# EAGLE design WildlifeCamera (EAGLE 9.6.2)
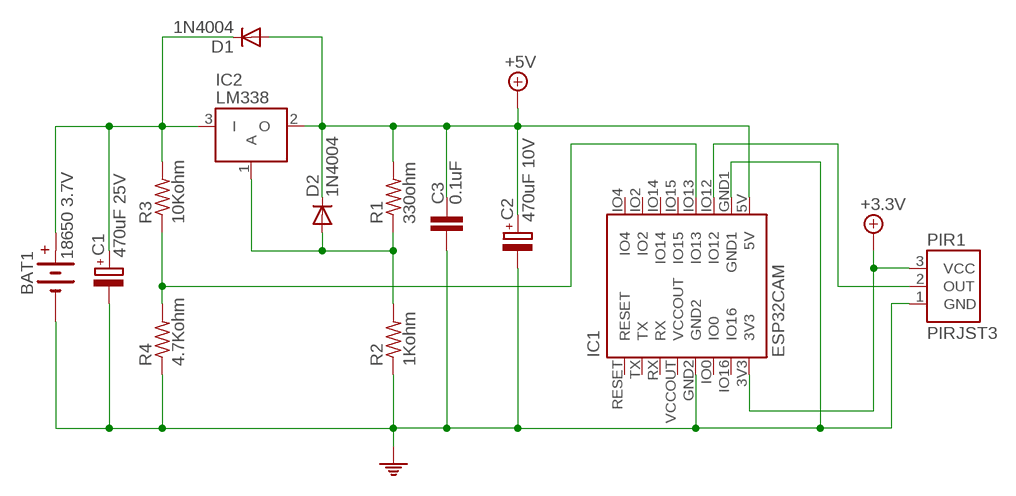
[diagram p0: schematic, sheet 1]

## Parts
BAT1  18650 3.7V  BATTERYSIL2  [SIL2]
C1  470uF 25V  CAPACITOR_EL5MM  [CAPACITOR-5MM]
C2  470uF 10V  CAPACITOR_EL5MM  [CAPACITOR-5MM]
C3  0.1uF  CAPACITOR5MM  [CAPACITOR-5MM]
D1  1N4004  DIODEBIG  [DIODE-BIG]
D2  1N4004  DIODEBIG  [DIODE-BIG]
IC1  ESP32CAM  [ESP32CAM]
IC2  LM338  LM317TO220  [TO220]
PIR1  PIRJST3  [JST3]
R1  330ohm  RESISTOR0.25W  [RESISTOR-0.25W]
R2  1Kohm  RESISTOR0.25W  [RESISTOR-0.25W]
R3  10Kohm  RESISTOR0.25W  [RESISTOR-0.25W]
R4  4.7Kohm  RESISTOR0.25W  [RESISTOR-0.25W]

## Nets
+3.3V: IC1.3V3 PIR1.3(VCC)
+5V: C2.1 C3.1 D1.A D2.C IC1.5V IC2.2(O) R1.2
GND: BAT1.2(-) C1.2 C2.2 C3.2 IC1.GND1 IC1.GND2 PIR1.1(GND) R2.1 R4.1
N$1: BAT1.1(+) C1.1 D1.C IC2.3(I) R3.2
N$2: IC1.IO13 R3.1 R4.2
N$3: D2.A IC2.1(A) R1.1 R2.2
N$6: IC1.IO12 PIR1.2(OUT)
Unconnected: IC1.IO0 IC1.IO2 IC1.IO4 IC1.IO14 IC1.IO15 IC1.IO16 IC1.RESET IC1.RX IC1.TX

## Power pins joined to a net without a drawn wire
VCCOUT: IC1.VCCOUT

## Library data of the parts
BAT1 = wizzent:BATTERY: Battery
C1 C2 = wizzent:CAPACITOR_EL: Electrolytic Capacitor
C3 = wizzent:CAPACITOR: Capacitor
D1 D2 = wizzent:DIODE: Diode
IC1 = wizzent:ESP32CAM: ESP32CAM
IC2 = wizzent:LM317: LM317 LM338; SPICEPREFIX: J
PIR1 = wizzent:PIR: PIR
R1-R4 = wizzent:RESISTOR: Resistor

## Board
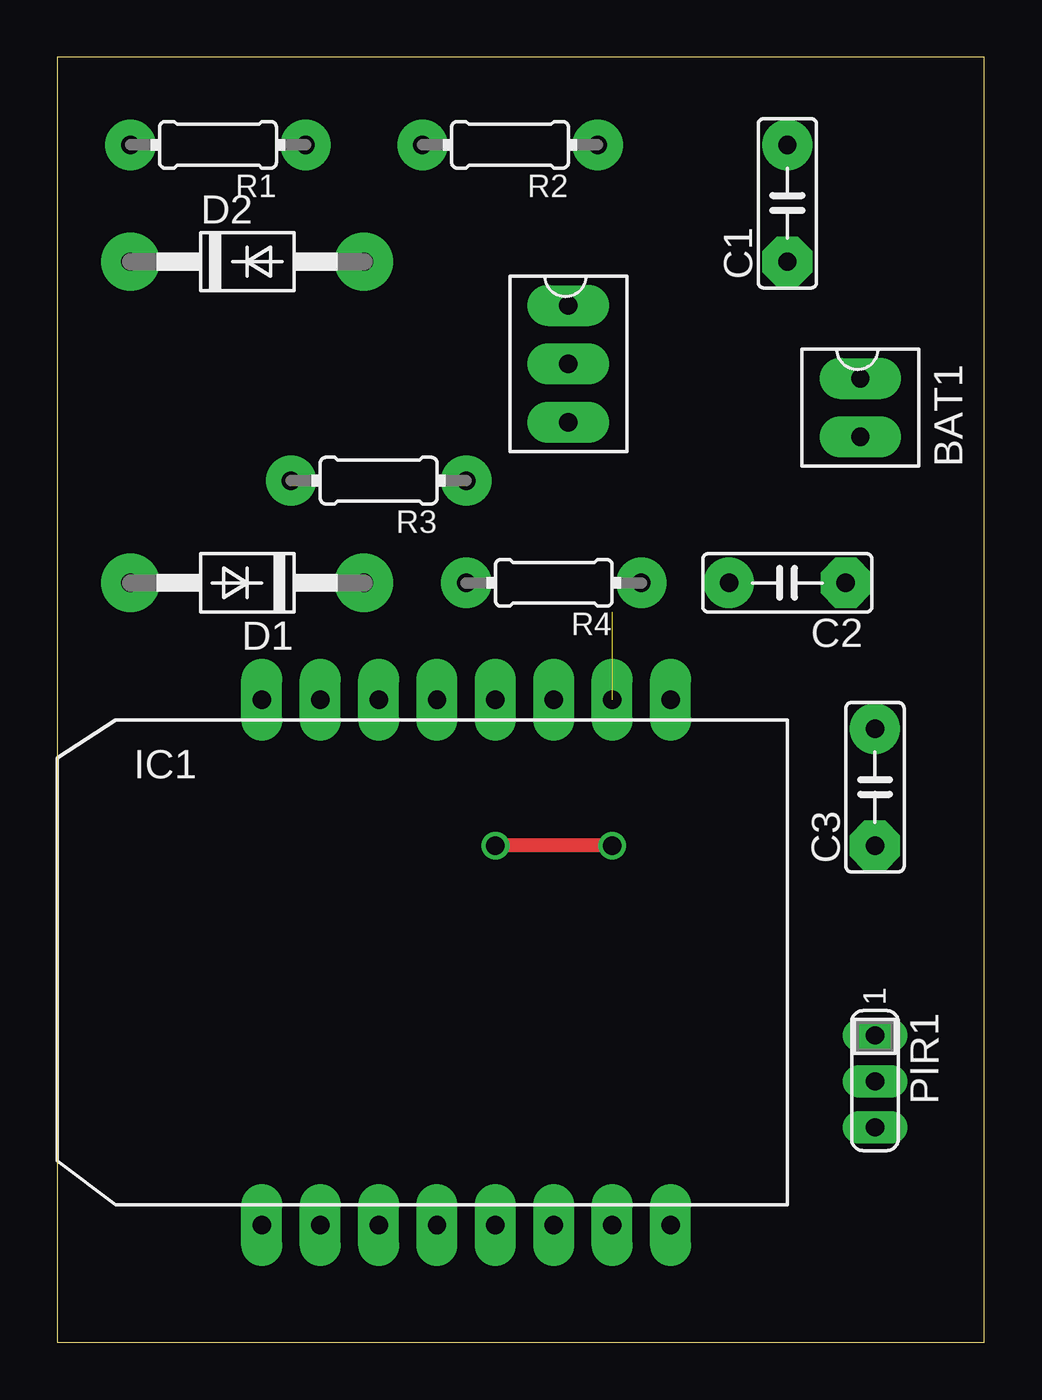
[diagram p1: board, top side]
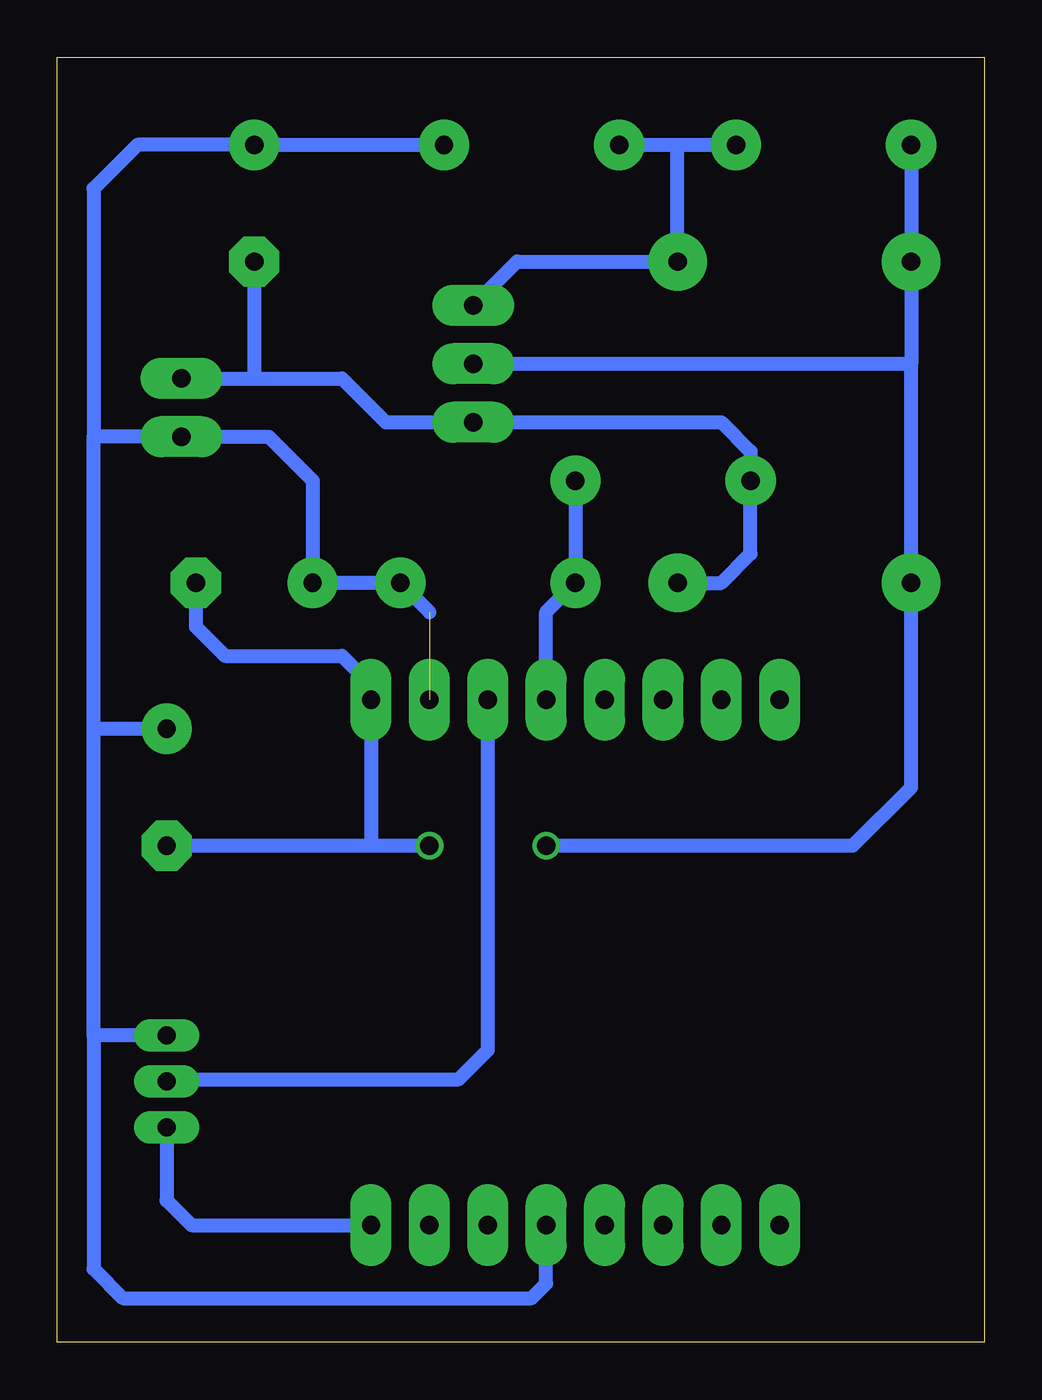
[diagram p2: board, bottom side, seen from below]

Size 40.31 x 55.87 mm. Coordinates in mm from the lower left corner, seen from the top.
Outline: 0,0 40.31,0 40.31,55.87 0,55.87 0,0
Copper layers (1*16): Top 0.035mm / dielectric 1.5mm / Bottom 0.035mm
Design rules "default": minimum track width 6mil, minimum drill 0.35mm, track to track 6mil, track to pad 6mil, pad to pad 6mil, via to via 6mil, smd to smd 6mil, copper to edge 40mil, drill to drill 6mil, minimum pad ring 10mil, minimum via ring 8mil, stop-mask expansion 4mil, vias tented up to drill 0mil, thermal gap 10mil

### Footprints (pad centres in the part's own frame; a part is rotated, then mirrored left to right if it is on the bottom)
SIL2 = drill 0.8 pad 1.778 long: 1 0,0; 2 2.54,0
CAPACITOR-5MM = drill 0.8 pad 2.184 octagon: 1 -2.54,0 | drill 0.8 pad 2.184: 2 2.54,0
DIODE-BIG = drill 0.8 pad 2.54: A 5.08,0; C -5.08,0
ESP32CAM = drill 0.8 pad 1.778 long: 3V3 17.78,0; 5V 17.78,22.86; GND1 15.24,22.86; GND2 10.16,0; IO0 12.7,0; IO2 2.54,22.86; IO4 0,22.86; IO12 12.7,22.86; IO13 10.16,22.86; IO14 5.08,22.86; IO15 7.62,22.86; IO16 15.24,0; RESET 0,0; RX 5.08,0; TX 2.54,0; VCCOUT 7.62,0
TO220 = drill 0.8 pad 1.778 long: 1 0,0; 2 2.54,0; 3 5.08,0
JST3 = drill 0.8 pad 1.422 long: 1 0,0; 2 2,0; 3 4,0
RESISTOR-0.25W = drill 0.8 pad 2.184: 1 -3.81,0; 2 3.81,0

### Placement (x,y rotation side)
BAT1  34.92,41.91 270 top
C1  31.75,49.53 90 top
C2  31.75,33.02 180 top
C3  35.56,24.13 90 top
D1  8.26,33.02 180 top
D2  8.26,46.99 0 top
IC1  8.89,5.08 0 top
IC2  22.23,45.09 270 top
PIR1  35.56,13.34 270 top
R1  6.99,52.07 180 top
R2  19.68,52.07 180 top
R3  13.97,37.47 180 top
R4  21.59,33.02 180 top

### Tracks (layer width: path | path; a pad name or v marks a point on that pad's centre or on a via)
+3.3V
  Bottom 0.61: PIR1.3 35.56,6.16 34.48,5.08 IC1.3V3
+5V  (via drill 0.8)
  Top 0.61: v24.13,21.59 v19.05,21.59
  Bottom 0.61: R1.2 D2.C 3.17,42.55 | IC2.2 3.17,42.55 | C2.1 34.29,31.11 33.02,29.84 27.94,29.84 26.67,28.57 IC1.5V 26.67,21.59 | C3.1 26.67,21.59 | 26.67,21.59 v24.13,21.59 | v19.05,21.59 5.71,21.59 3.17,24.13 D1.A 3.17,42.55
GND  (1 unrouted)
  Bottom 0.61: 38.73,39.37 BAT1.2 31.11,39.37 29.21,37.47 C2.2 R4.1 24.13,31.75 | C3.2 38.73,26.67 | 38.73,26.67 38.73,39.37 | R2.1 C1.2 36.83,52.07 38.73,50.16 38.73,39.37 | PIR1.1 38.73,13.34 | 38.73,13.34 38.73,26.67 | 38.73,13.34 38.73,3.17 37.47,1.91 19.68,1.91 19.05,2.54 IC1.GND2
N$1
  Bottom 0.61: D1.C 11.43,33.02 10.16,34.29 R3.2 10.16,38.73 11.43,40.01 IC2.3 26.04,40.01 27.94,41.91 31.75,41.91 | BAT1.1 31.75,41.91 | C1.1 31.75,41.91
N$2
  Bottom 0.61: R3.1 R4.2 19.05,31.75 IC1.IO13
N$3
  Bottom 0.61: R2.2 13.34,52.07 | 13.34,52.07 R1.1 | 13.34,52.07 D2.A 20.32,46.99 IC2.1
N$6
  Bottom 0.61: IC1.IO12 21.59,12.7 22.86,11.43 35.47,11.43 PIR1.2